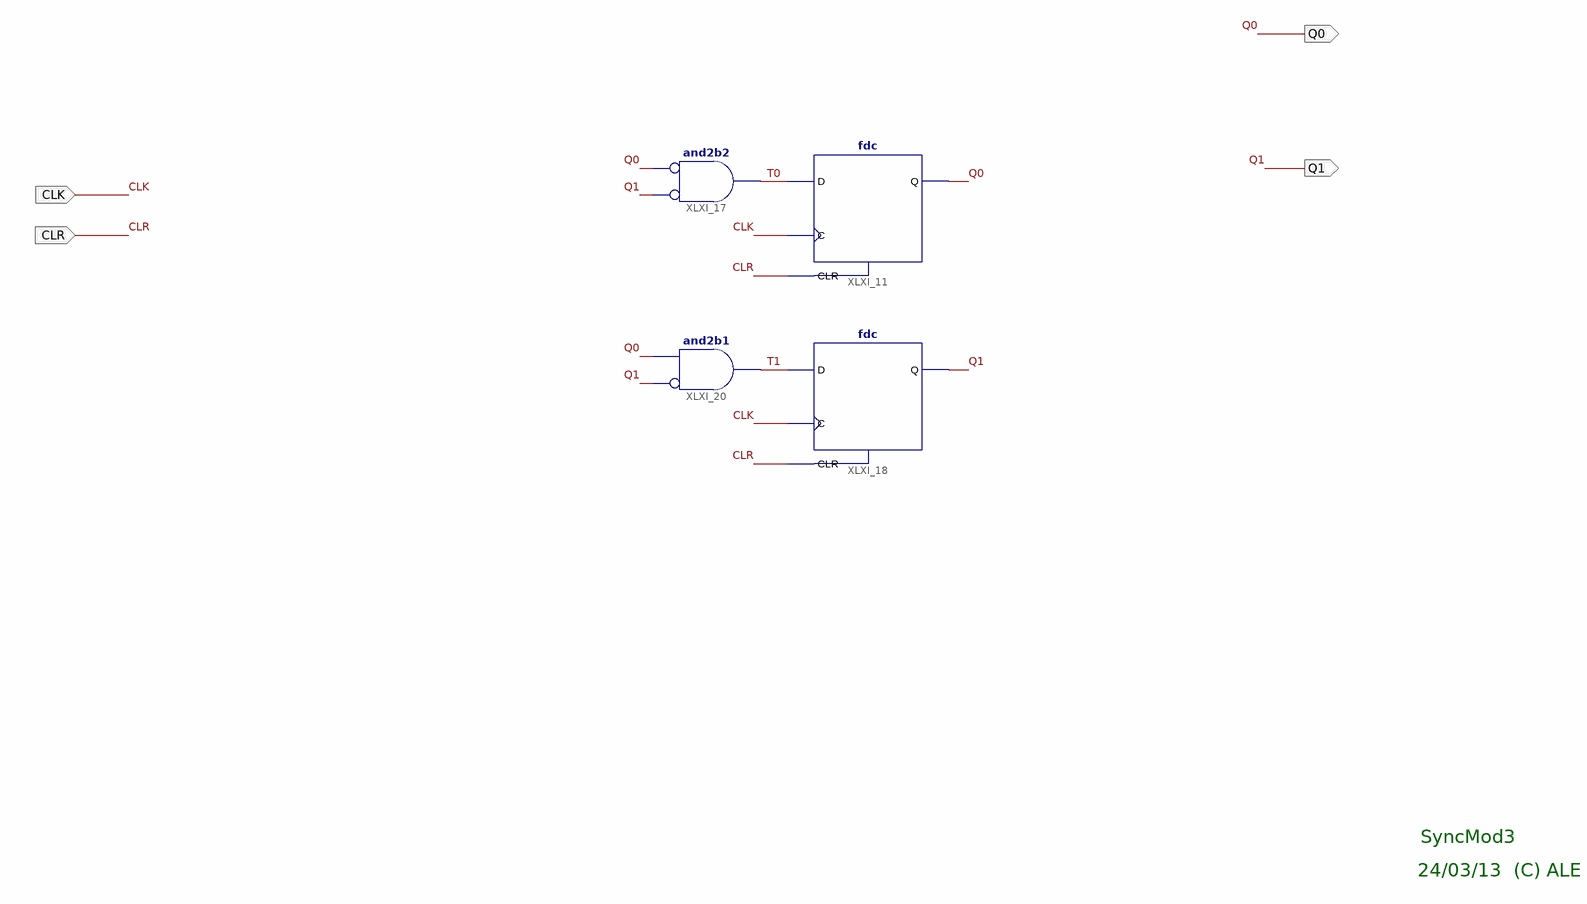
[diagram p0: schematic sheet 1]
// Xilinx ISE schematic SyncMod3.sch (spartan3e) as structural Verilog: 4 symbols, 4 ports
module SyncMod3 (
  input  CLK,
  input  CLR,
  output Q0,
  output Q1
);

  wire T0, T1;

  fdc XLXI_11 (.C(CLK), .CLR(CLR), .D(T0), .Q(Q0));
  and XLXI_17 (T0, ~Q1, ~Q0);  // and2b2
  fdc XLXI_18 (.C(CLK), .CLR(CLR), .D(T1), .Q(Q1));
  and XLXI_20 (T1, ~Q1, Q0);  // and2b1

  // Notes on the sheet:
  //   SyncMod3
  //   24/03/13  (C) ALE
endmodule
